# EAGLE design LCD Breakout (EAGLE 5.11)
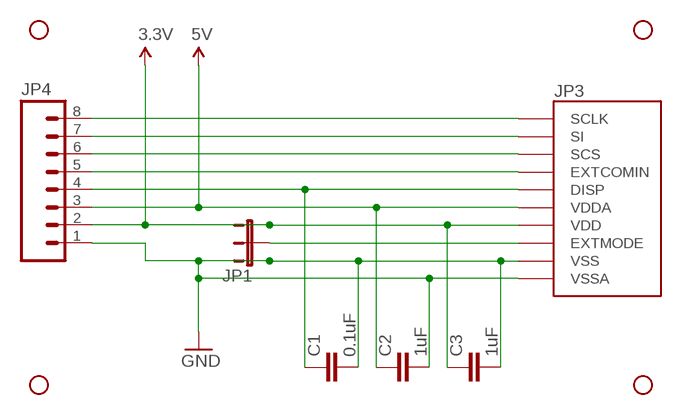
[diagram p0: schematic, sheet 1]

## Parts
C1  0.1uF  CAP0805-LARGE  [0805-LARGE-PAD]
C2  1uF  CAP0805-LARGE  [0805-LARGE-PAD]
C3  1uF  CAP0805-LARGE  [0805-LARGE-PAD]
JP1  JUMPER-3PTH  [1X03]
JP2  STAND-OFF  [STAND-OFF]
JP3  LS013B4DN02  [FPC-6288-10]
JP4  M08LONGPADS  [1X08_LONGPADS]
JP5  STAND-OFF  [STAND-OFF]
JP6  STAND-OFF  [STAND-OFF]
JP7  STAND-OFF  [STAND-OFF]

## Nets
3.3V: C3.1 JP1.3 JP3.7(VDD) JP4.2
5V: C2.1 JP3.6(VDDA) JP4.3
GND: C1.2 C2.2 C3.2 JP1.1 JP3.9(VSS) JP3.10(VSSA) JP4.1
N$1: JP1.2 JP3.8(EXTMODE)
N$6: C1.1 JP3.5(DISP) JP4.4
N$7: JP3.4(EXTCOMIN) JP4.5
N$8: JP3.3(SCS) JP4.6
N$9: JP3.2(SI) JP4.7
N$10: JP3.1(SCLK) JP4.8

## Library data of the parts
C1-C3 = SparkFun:CAP: Capacitor Standard 0603 ceramic capacitor, and 0.1" leaded capacitor.
JP1 = SparkFun:JUMPER-3
JP2 JP5-JP7 = SparkFun:STAND-OFF: Stand Off This is the mechanical footprint for a #4 phillips button head screw. Use the keepout ring to avoid running the screw head into surrounding components. SKU : PRT-00447
JP3 = 00-my-parts:LS013B4DN02: Sharp LS013B4DN02 LCD Display
JP4 = SparkFun:M08: Header 8 Standard 8-pin 0.1" header. Use with straight break away headers (SKU : PRT-00116), right angle break away headers (PRT-00553), swiss pins (PRT-00743), machine pins (PRT-00117), and female headers (PRT-00115).

## Board
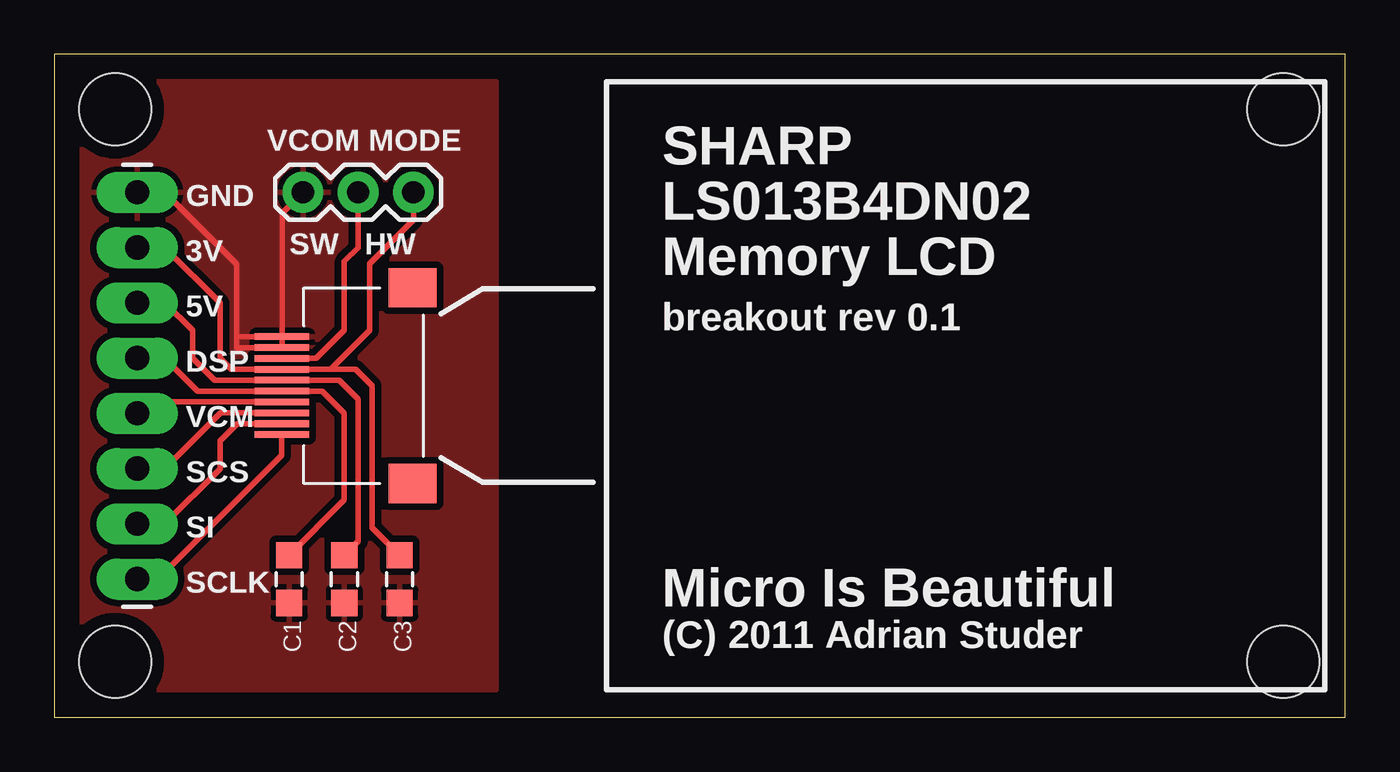
[diagram p1: board, top side]

Size 59.36 x 30.47 mm. Coordinates in mm from the lower left corner, seen from the top.
Outline: 0,0 59.36,0 59.36,30.47 0,30.47 0,0
Copper layers (1*16): Top 0.0356mm / dielectric 1.5011mm / Bottom 0.0356mm
Design rules "LaenPCBOrder": minimum track width 6mil, minimum drill 13mil, track to track 6mil, track to pad 6mil, pad to pad 6mil, via to via 6mil, smd to smd 6mil, copper to edge 15mil, drill to drill 6mil, minimum pad ring 7mil, minimum via ring 7mil, stop-mask expansion 4mil, vias tented up to drill 0mil, thermal gap 10mil

### Footprints (pad centres in the part's own frame; a part is rotated, then mirrored left to right if it is on the bottom)
0805-LARGE-PAD = smd 1.2 x 1.2: 1 -1.1,0; 2 1.1,0
1X03 = drill 1.016 pad 1.88 round: 1 0,0; 2 2.54,0; 3 5.08,0
STAND-OFF = hole 3.302: 0,0
FPC-6288-10 = smd 0.3 x 2.5: 1 -2.25,3.5; 2 -1.75,3.5; 3 -1.25,3.5; 4 -0.75,3.5; 5 -0.25,3.5; 6 0.25,3.5; 7 0.75,3.5; 8 1.25,3.5; 9 1.75,3.5; 10 2.25,3.5 | smd 1.8 x 2.2: NC1 -4.5,-2.5; NC2 4.5,-2.5
1X08_LONGPADS = drill 1.118 pad 1.88 long: 1 0,0; 2 2.54,0; 3 5.08,0; 4 7.62,0; 5 10.16,0; 6 12.7,0; 7 15.24,0; 8 17.78,0

### Placement (x,y rotation side)
C1  10.79,6.35 270 top
C2  13.33,6.35 270 top
C3  15.87,6.35 270 top
JP1  11.43,24.13 0 top
JP2  2.79,2.54 0 top
JP3  13.97,15.24 90 top
JP4  3.81,24.13 270 top
JP5  2.79,27.94 0 top
JP6  56.52,27.94 0 top
JP7  56.52,2.54 0 top

### Tracks (layer width: path | path; a pad name or v marks a point on that pad's centre or on a via)
3.3V
  Top 0.254: 12.7,15.99 13.85,15.99 14.6,15.24 14.6,8.72 C3.1 | 12.7,15.99 JP3.7 8.14,15.99 7.62,16.51 7.62,19.05 5.08,21.59 JP4.2 | JP1.3 16.51,22.86 14.49,20.84 14.49,17.78 12.7,15.99
5V
  Top 0.254: C2.1 13.97,8.09 13.97,14.6 13.08,15.49 JP3.6 7.37,15.49 6.35,16.51 6.35,17.78 5.08,19.05 JP4.3
GND
  Top 0.254: 8.38,17.49 JP3.10 | 8.38,17.49 8.38,20.83 5.08,24.13 JP4.1 | 8.38,17.49 8.38,16.99 JP3.9 10.47,23.17 JP1.1
  pour Top (isolate 0.305): 1.27,29.21 20.32,29.21 20.32,1.27 1.27,1.27
N$1
  Top 0.254: JP3.8 12.04,16.49 13.33,17.78 13.33,20.95 13.97,21.59 JP1.2
N$6
  Top 0.254: JP4.4 5.08,16.51 6.6,14.99 JP3.5 12.31,14.99 13.33,13.97 13.33,9.99 C1.1
N$7
  Top 0.254: JP3.4 4.33,14.49 JP4.5
N$8
  Top 0.254: JP3.3 7.64,13.99 5.08,11.43 JP4.6
N$9
  Top 0.254: 4.7,9.02 3.94,9.02 JP4.7 5.08,8.89 7.62,11.43 7.62,12.7 8.41,13.49 JP3.2
N$10
  Top 0.254: JP3.1 10.45,12.99 10.45,12.04 4.76,6.35 JP4.8

### Text on the board
_tsilk: VCOM MODE | SHARP | GND | LS013B4DN02 | 3V | SW HW | Memory LCD | 5V | breakout rev 0.1 | DSP | VCM | SCS | SI | SCLK | Micro Is Beautiful | (C) 2011 Adrian Studer